# EAGLE design WarpDrive_201903 (EAGLE 6.1)

## Sheet 1 of 3
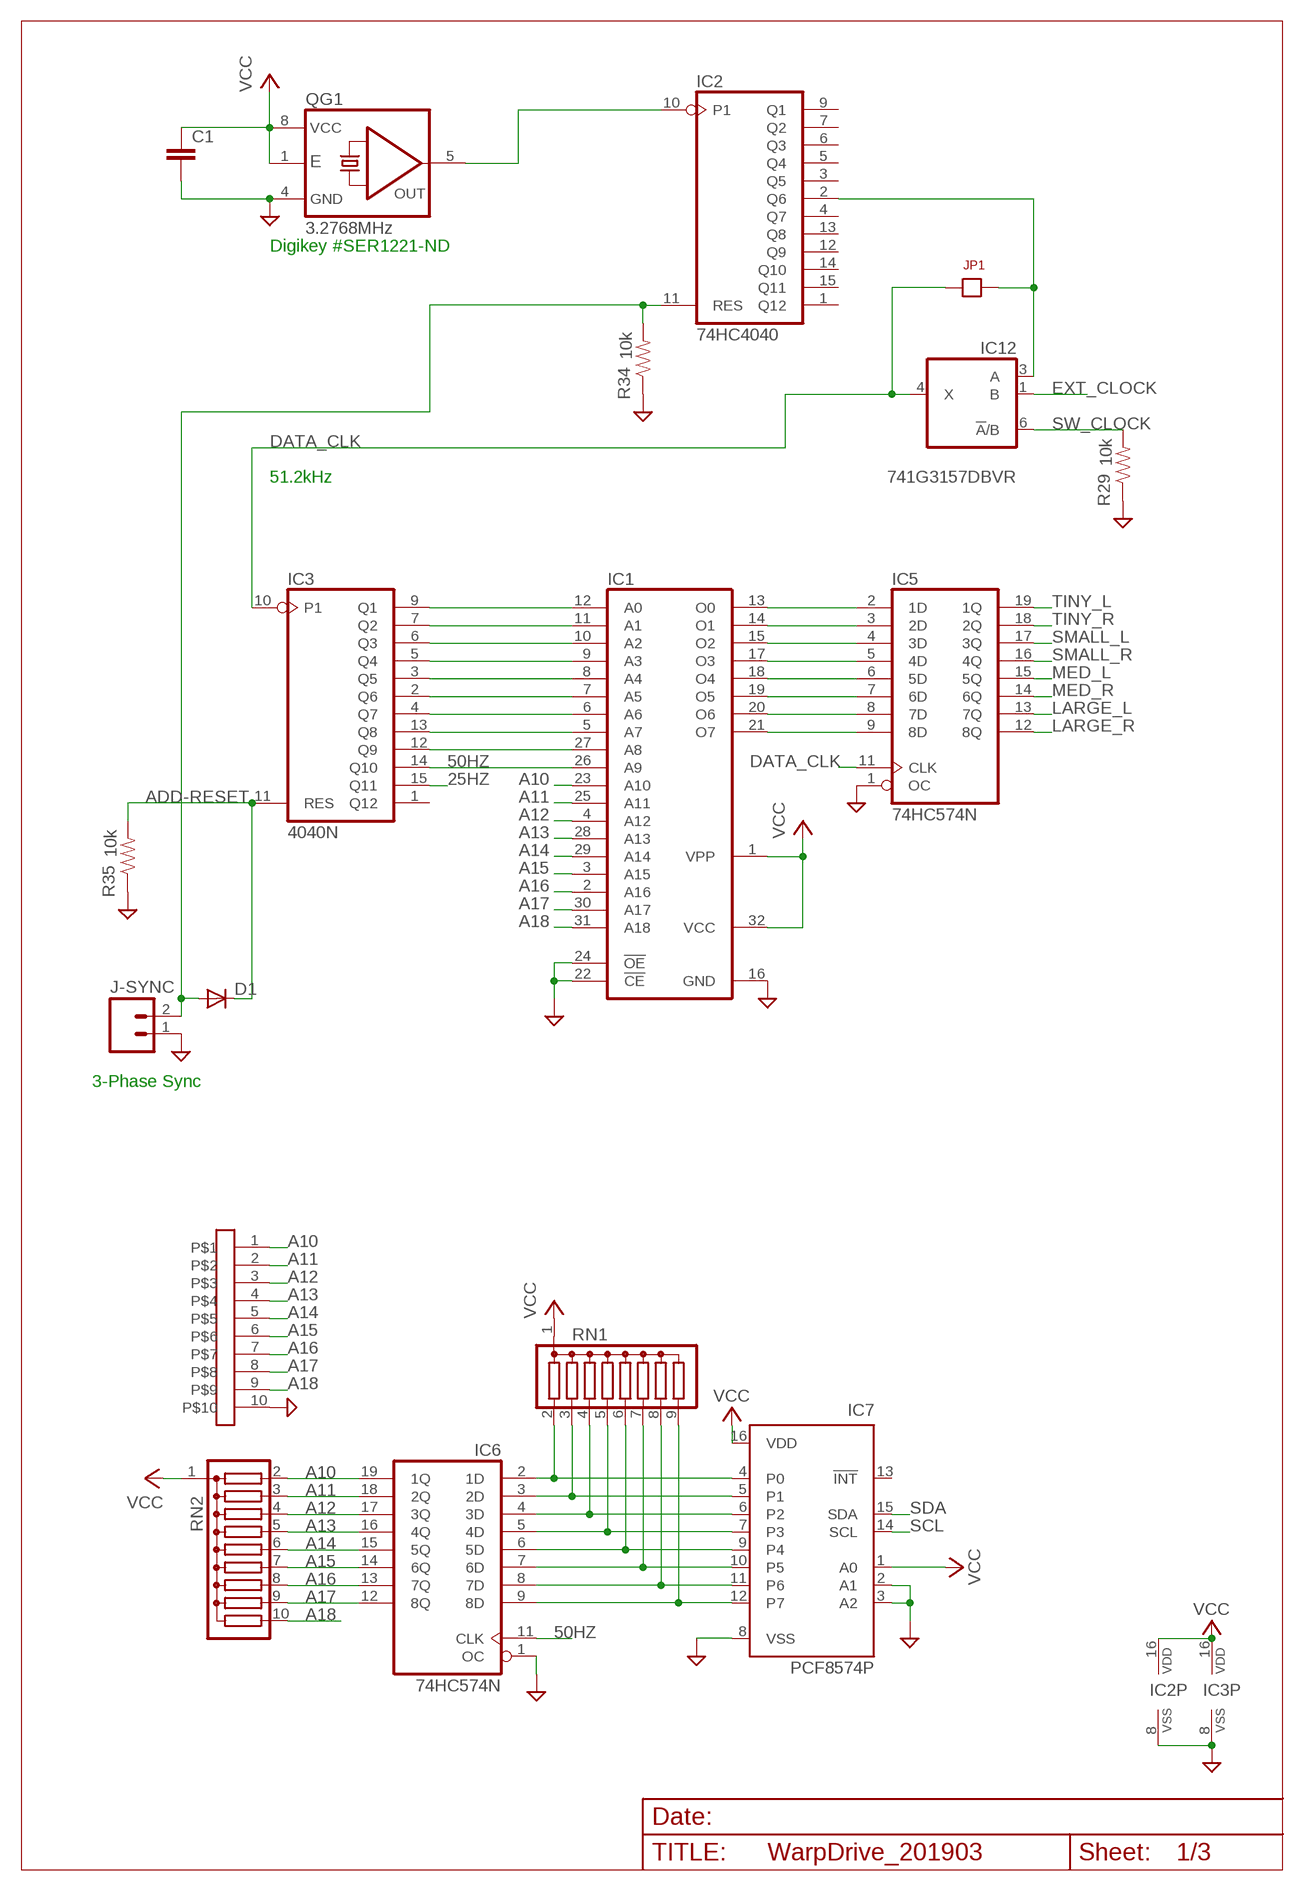
[diagram p0: schematic, sheet 1]

### Parts
C1  BCAP  [BCAP]
D1  1N4148DO35-7  [D3]
IC1  27C4001D  [DIL32]
IC2  74HC4040  4040N  [DIL16]
IC3  4040N  [DIL16]
IC5  74HC574N  [DIL20]
IC6  74HC574N  [DIL20]
IC7  PCF8574P  [DIL16]
IC12  741G3157DBVR  [DBV_R-PDSO-G6]
J1  SIL-STACK-10  [SIL-STACK-10]
J-SYNC  MO2POL  [MOLEX-1X2]
JP1  JP1  [JP1]
QG1  3.2768MHz  SG531  [DIL08-4]
R29  10k  R4  [AXIAL-0.4]
R34  10k  R4  [AXIAL-0.4]
R35  10k  R4  [AXIAL-0.4]
RN1  G08R  [SIL9]
RN2  G09R  [SIL10]

### Nets
25HZ: IC3.15(Q11)
50HZ: IC1.26(A9) IC3.14(Q10) IC6.11(CLK) ; also sheet 3
A10: IC1.23(A10) IC6.19(1Q) J1.1 RN2.2
A11: IC1.25(A11) IC6.18(2Q) J1.2 RN2.3
A12: IC1.4(A12) IC6.17(3Q) J1.3 RN2.4
A13: IC1.28(A13) IC6.16(4Q) J1.4 RN2.5
A14: IC1.29(A14) IC6.15(5Q) J1.5 RN2.6
A15: IC1.3(A15) IC6.14(6Q) J1.6 RN2.7
A16: IC1.2(A16) IC6.13(7Q) J1.7 RN2.8
A17: IC1.30(A17) IC6.12(8Q) J1.8 RN2.9
A18: IC1.31(A18) J1.9 RN2.10 ; also sheet 3
ADD-RESET: D1.C IC3.11(RES) R35.P$2 ; also sheet 3
DATA_CLK: IC3.10(P1) IC5.11(CLK) IC12.4(X) JP1.1 ; also sheet 3
EXT_CLOCK: IC12.1(B) ; also sheet 3
GND: C1.2 IC1.16(GND) IC1.22(!CE) IC1.24(!OE) IC2.8(VSS) IC3.8(VSS) IC5.1(OC) IC6.1(OC) IC7.2(A1) IC7.3(A2) IC7.8(VSS) J1.10 J-SYNC.1 QG1.4(GND) R29.P$1 R34.P$1 R35.P$1 ; also sheet 3
LARGE_L: IC5.13(7Q) ; also sheet 2
LARGE_R: IC5.12(8Q) ; also sheet 2
MED_L: IC5.15(5Q) ; also sheet 2
MED_R: IC5.14(6Q) ; also sheet 2
N$2: IC2.10(P1) QG1.5(OUT)
N$3: IC1.12(A0) IC3.9(Q1)
N$4: IC1.11(A1) IC3.7(Q2)
N$5: IC1.10(A2) IC3.6(Q3)
N$6: IC1.9(A3) IC3.5(Q4)
N$7: IC1.8(A4) IC3.3(Q5)
N$8: IC1.7(A5) IC3.2(Q6)
N$9: IC1.6(A6) IC3.4(Q7)
N$10: IC1.5(A7) IC3.13(Q8)
N$11: IC1.27(A8) IC3.12(Q9)
N$12: IC1.13(O0) IC5.2(1D)
N$13: IC2.2(Q6) IC12.3(A) JP1.2
N$14: IC1.14(O1) IC5.3(2D)
N$15: IC6.2(1D) IC7.4(P0) RN1.2
N$16: IC1.15(O2) IC5.4(3D)
N$17: IC1.17(O3) IC5.5(4D)
N$18: IC1.18(O4) IC5.6(5D)
N$19: IC1.19(O5) IC5.7(6D)
N$20: IC1.20(O6) IC5.8(7D)
N$21: IC1.21(O7) IC5.9(8D)
N$24: IC6.3(2D) IC7.5(P1) RN1.3
N$25: IC6.4(3D) IC7.6(P2) RN1.4
N$26: IC6.5(4D) IC7.7(P3) RN1.5
N$27: IC6.6(5D) IC7.9(P4) RN1.6
N$28: IC6.7(6D) IC7.10(P5) RN1.7
N$29: IC6.8(7D) IC7.11(P6) RN1.8
N$30: IC6.9(8D) IC7.12(P7) RN1.9
N$75: D1.A IC2.11(RES) J-SYNC.2 R34.P$2
SCL: IC7.14(SCL) ; also sheet 3
SDA: IC7.15(SDA) ; also sheet 3
SMALL_L: IC5.17(3Q) ; also sheet 2
SMALL_R: IC5.16(4Q) ; also sheet 2
SW_CLOCK: IC12.6(!A!/B) R29.P$2 ; also sheet 3
TINY_L: IC5.19(1Q) ; also sheet 2
TINY_R: IC5.18(2Q) ; also sheet 2
VCC: C1.1 IC1.1(VPP) IC1.32(VCC) IC2.16(VDD) IC3.16(VDD) IC7.1(A0) IC7.16(VDD) QG1.1(E) QG1.8(VCC) RN1.1 RN2.1 ; also sheet 3
Unconnected: IC2.1(Q12) IC2.3(Q5) IC2.4(Q7) IC2.5(Q4) IC2.6(Q3) IC2.7(Q2) IC2.9(Q1) IC2.12(Q9) IC2.13(Q8) IC2.14(Q10) IC2.15(Q11) IC3.1(Q12) IC7.13(!INT)

### Notes on the sheet
- Digikey #SER1221-ND
- 51.2kHz
- 3-Phase Sync

## Sheet 2 of 3
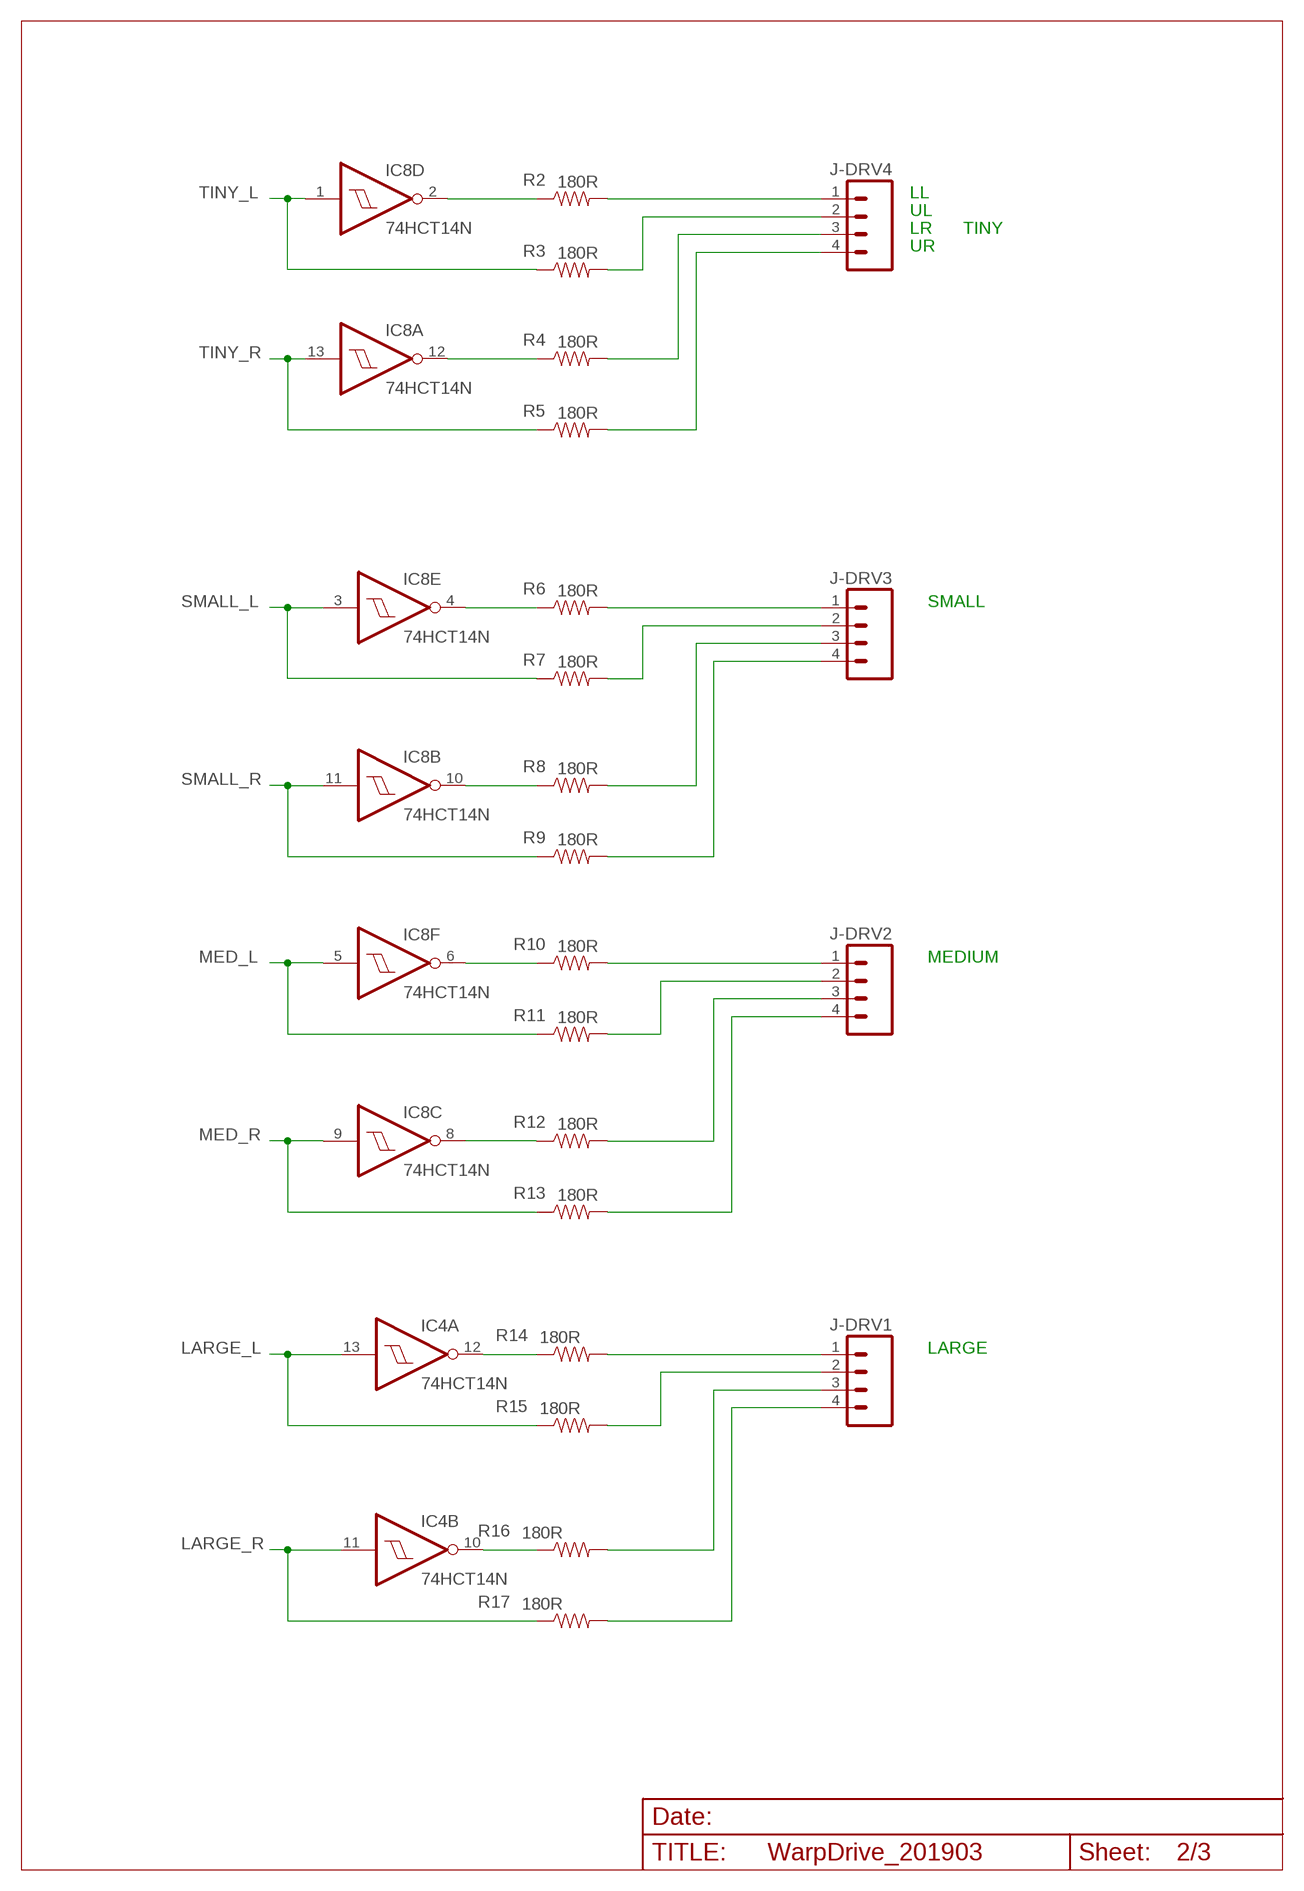
[diagram p1: schematic, sheet 2]

### Parts
IC4  74HCT14N  [DIL14]
IC8  74HCT14N  [DIL14]
J-DRV1  MO4POL  [MOLEX-4]
J-DRV2  MO4POL  [MOLEX-4]
J-DRV3  MO4POL  [MOLEX-4]
J-DRV4  MO4POL  [MOLEX-4]
R2  180R  R4  [AXIAL-0.4]
R3  180R  R4  [AXIAL-0.4]
R4  180R  R4  [AXIAL-0.4]
R5  180R  R4  [AXIAL-0.4]
R6  180R  R4  [AXIAL-0.4]
R7  180R  R4  [AXIAL-0.4]
R8  180R  R4  [AXIAL-0.4]
R9  180R  R4  [AXIAL-0.4]
R10  180R  R4  [AXIAL-0.4]
R11  180R  R4  [AXIAL-0.4]
R12  180R  R4  [AXIAL-0.4]
R13  180R  R4  [AXIAL-0.4]
R14  180R  R4  [AXIAL-0.4]
R15  180R  R4  [AXIAL-0.4]
R16  180R  R4  [AXIAL-0.4]
R17  180R  R4  [AXIAL-0.4]

### Nets
LARGE_L: IC4.13(A:I) R15.P$1 ; also sheet 1
LARGE_R: IC4.11(B:I) R17.P$1 ; also sheet 1
MED_L: IC8.5(F:I) R11.P$1 ; also sheet 1
MED_R: IC8.9(C:I) R13.P$1 ; also sheet 1
N$22: IC4.12(A:O) R14.P$1
N$23: IC4.10(B:O) R16.P$1
N$31: IC8.2(D:O) R2.P$1
N$32: J-DRV4.1 R2.P$2
N$33: J-DRV4.2 R3.P$2
N$34: IC8.12(A:O) R4.P$1
N$35: J-DRV4.3 R4.P$2
N$36: J-DRV4.4 R5.P$2
N$38: IC8.4(E:O) R6.P$1
N$39: J-DRV3.1 R6.P$2
N$41: J-DRV3.2 R7.P$2
N$44: IC8.10(B:O) R8.P$1
N$46: J-DRV3.3 R8.P$2
N$47: J-DRV3.4 R9.P$2
N$49: IC8.6(F:O) R10.P$1
N$50: J-DRV2.1 R10.P$2
N$52: J-DRV2.2 R11.P$2
N$55: IC8.8(C:O) R12.P$1
N$56: J-DRV2.3 R12.P$2
N$57: J-DRV2.4 R13.P$2
N$61: J-DRV1.1 R14.P$2
N$62: J-DRV1.2 R15.P$2
N$65: J-DRV1.3 R16.P$2
N$66: J-DRV1.4 R17.P$2
SMALL_L: IC8.3(E:I) R7.P$1 ; also sheet 1
SMALL_R: IC8.11(B:I) R9.P$1 ; also sheet 1
TINY_L: IC8.1(D:I) R3.P$1 ; also sheet 1
TINY_R: IC8.13(A:I) R5.P$1 ; also sheet 1
Unconnected: IC4.3(E:I) IC4.4(E:O) IC4.5(F:I) IC4.6(F:O) IC4.8(C:O) IC4.9(C:I)

### Notes on the sheet
- LL
- UL
- LR | TINY
- UR
- SMALL
- MEDIUM
- LARGE

## Sheet 3 of 3
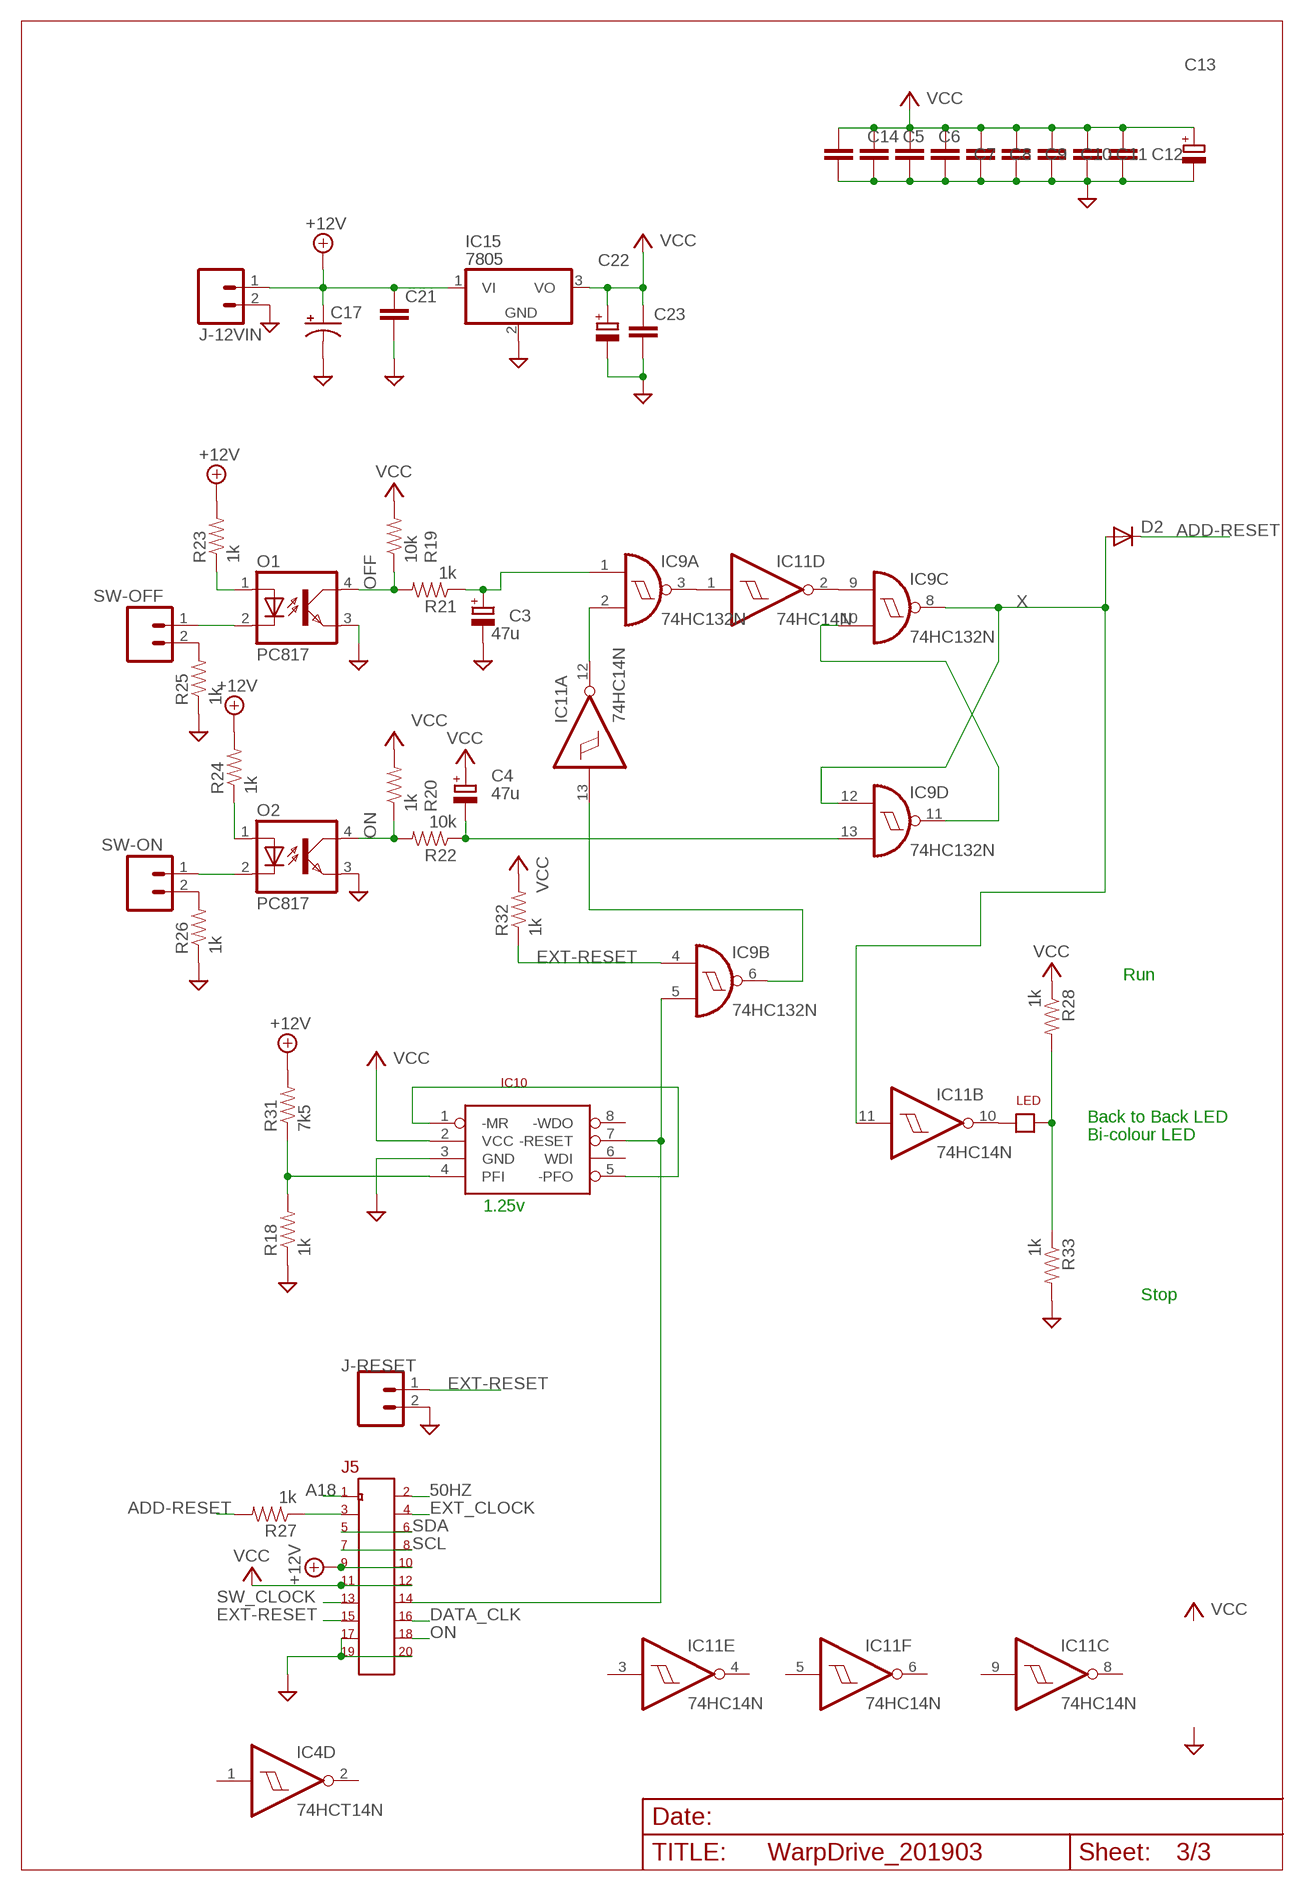
[diagram p2: schematic, sheet 3]

### Parts
C3  47u  C-RB200100  [CPOL-RADIAL-10UF-25V]
C4  47u  C-RB200100  [CPOL-RADIAL-10UF-25V]
C5  BCAP  [BCAP]
C6  BCAP  [BCAP]
C7  BCAP  [BCAP]
C8  BCAP  [BCAP]
C9  BCAP  [BCAP]
C10  BCAP  [BCAP]
C11  BCAP  [BCAP]
C12  BCAP  [BCAP]
C13  C-RB200100  [CPOL-RADIAL-10UF-25V]
C14  BCAP  [BCAP]
C17  CAP_POLPTH1  [CPOL-RADIAL-100UF-25V]
C21  BCAP  [BCAP]
C22  C-RB200100  [CPOL-RADIAL-10UF-25V]
C23  BCAP  [BCAP]
D2  1N4148DO35-7  [D3]
IC9  74HC132N  [DIL14]
IC10  ADM705  [DIL08]
IC11  74HC14N  [DIL14]
IC15  7805  7805TV  [TO220V]
J5  IDC20IDC20-SMALL  [IDC20-SMALL]
J-12VIN  MO2POL  [MOLEX-1X2]
J-RESET  MO2POL  [MOLEX-1X2]
LED  JP1  [JP1]
O1  PC817  [DIL04]
O2  PC817  [DIL04]
R18  1k  R4  [AXIAL-0.4]
R19  10k  R4  [AXIAL-0.4]
R20  1k  R4  [AXIAL-0.4]
R21  1k  R4  [AXIAL-0.4]
R22  10k  R4  [AXIAL-0.4]
R23  1k  R4  [AXIAL-0.4]
R24  1k  R4  [AXIAL-0.4]
R25  1k  R4  [AXIAL-0.4]
R26  1k  R4  [AXIAL-0.4]
R27  1k  R4  [AXIAL-0.4]
R28  1k  R4  [AXIAL-0.4]
R31  7k5  R4  [AXIAL-0.4]
R32  1k  R4  [AXIAL-0.4]
R33  1k  R4  [AXIAL-0.4]
SW-OFF  MO2POL  [MOLEX-1X2]
SW-ON  MO2POL  [MOLEX-1X2]

### Nets
50HZ: J5.2 ; also sheet 1
+12V: C17.1(+) C21.1 IC15.1(VI) J5.9 J5.10 J-12VIN.1 R23.P$2 R24.P$2 R31.P$2
A18: J5.1 ; also sheet 1
ADD-RESET: D2.C R27.P$2 ; also sheet 1
DATA_CLK: J5.16 ; also sheet 1
EXT-RESET: IC9.4(B:I0) J5.15 J-RESET.1 R32.P$1
EXT_CLOCK: J5.4 ; also sheet 1
GND: C3.2(-) C5.2 C6.2 C7.2 C8.2 C9.2 C10.2 C11.2 C12.2 C13.2(-) C14.2 C17.2(-) C21.2 C22.2(-) C23.2 IC10.3(GND) IC15.2(GND) J5.17 J5.19 J5.20 J-12VIN.2 J-RESET.2 O1.3(EMIT) O2.3(EMIT) R18.P$1 R25.P$1 R26.P$1 R33.P$2 ; also sheet 1
N$37: IC9.9(C:I0) IC11.2(D:O)
N$40: LED.2 R28.P$2 R33.P$1
N$42: R25.P$2 SW-OFF.2
N$43: J5.3 R27.P$1
N$45: R26.P$2 SW-ON.2
N$48: IC9.10(C:I1) IC9.11(D:O)
N$51: C3.1(+) IC9.1(A:I0) R21.P$1
N$53: IC9.3(A:O) IC11.1(D:I)
N$54: C4.2(-) IC9.13(D:I1) R22.P$1
N$58: O1.1(A) R23.P$1
N$60: O1.2(C) SW-OFF.1
N$63: O2.1(A) R24.P$1
N$67: O2.2(C) SW-ON.1
N$69: IC9.2(A:I1) IC11.12(A:O)
N$70: IC9.6(B:O) IC11.13(A:I)
N$71: IC9.5(B:I1) IC10.7(-RESET) J5.14
N$72: IC10.1(-MR) IC10.5(-PFO)
N$73: IC10.4(PFI) R18.P$2 R31.P$1
N$74: IC11.10(B:O) LED.1
OFF: O1.4(COL) R19.P$1 R21.P$2
ON: J5.18 O2.4(COL) R20.P$1 R22.P$2
SCL: J5.7 J5.8 ; also sheet 1
SDA: J5.5 J5.6 ; also sheet 1
SW_CLOCK: J5.13 ; also sheet 1
VCC: C4.1(+) C5.1 C6.1 C7.1 C8.1 C9.1 C10.1 C11.1 C12.1 C13.1(+) C14.1 C22.1(+) C23.1 IC10.2(VCC) IC15.3(VO) J5.11 J5.12 R19.P$2 R20.P$2 R28.P$1 R32.P$2 ; also sheet 1
X: D2.A IC9.8(C:O) IC9.12(D:I0) IC11.11(B:I)
Unconnected: IC4.1(D:I) IC4.2(D:O) IC10.6(WDI) IC10.8(-WDO) IC11.3(E:I) IC11.4(E:O) IC11.5(F:I) IC11.6(F:O) IC11.8(C:O) IC11.9(C:I)

### Notes on the sheet
- Run
- Back to Back LED
- Bi-colour LED
- 1.25v
- Stop

## Power pins joined to a net without a drawn wire
GND: IC4.7(P:GND) IC5.10(GND) IC6.10(GND) IC8.7(P:GND) IC9.7(P:GND) IC11.7(P:GND) IC12.2(GND)
VCC: IC4.14(P:VCC) IC5.20(VCC) IC6.20(VCC) IC8.14(P:VCC) IC9.14(P:VCC) IC11.14(P:VCC) IC12.5(VCC)

## Library data of the parts
C1 C5-C12 C14 C21 C23 = Andrew Misc:BCAP
C3 C4 C13 C22 = Andrew:C-RB200100
C17 = SparkFun-Passives:CAP_POL: Capacitor Polarized These are standard SMD and PTH capacitors. Normally 10uF, 47uF, and 100uF in electrolytic and tantalum varieties. Always verify the external diameter of the through hole cap, it varies with capacity, voltage, and manufacturer. The EIA devices should be standard.
D1 D2 = Andrew Misc:1N4148: DIODE high speed (Philips)
IC1 = memory-nec:27C4001D: MEMORY; MPN: M27C4001-12B1; OC_FARNELL: 3338137; OC_NEWARK: 37M4736
IC2 IC3 = 40xx:4040: 12-stage binary/ripple COUNTER
IC4 IC8 IC11 = 74xx-eu:74*14: Hex schmitt trigger INVERTER
IC5 IC6 = 74xx-eu:74*574: 8-bit D type FLIP FLOP bus driver
IC7 = micro-philips:PCF8574: I2C-Bus Remote 8-bit I/O expander http://www.semiconductors.philips.com/acrobat_download/datasheets/PCF8574_4.pdf; MPN: PCF8574PN; OC_FARNELL: 204020; OC_NEWARK: 11N8515
IC9 = 74xx-eu:74*132: Quad 2-input NAND schmitt trigger
IC10 = Andrew IC:ADM705
IC12 = 74xx-little-us:74*1G3157: Single-Pole, Double-Throw Analog Switch Source: http://focus.ti.com/lit/ds/symlink/sn74lvc1g3157.pdf
IC15 = Andrew Linear:78*: Positive VOLTAGE REGULATOR Source: http://cache.national.com/ds/LM/LM78L05.pdf http://www.fairchildsemi.com/ds/LM/LM7805.pdf
J1 = Andrew_Connectors:SIL-STACK-10
J5 = Andrew Connectors:IDC20
J-12VIN J-RESET SW-OFF SW-ON = Andrew Connectors:MO2POL
J-DRV1-J-DRV4 = Andrew_Connectors:MO4POL
J-SYNC = Andrew_Connectors:MO2POL
JP1 LED = Andrew_Connectors:JP1
O1 O2 = Andrew:PC817: SHARP OPTO COUPLER; MPN: PC817X4J000F; OC_FARNELL: 9707727; OC_NEWARK: 97K7059
QG1 = Andrew IC:SG531: CRYSTAL RESONATOR; MPN: SG531P16MHZ; OC_FARNELL: unknown; OC_NEWARK: 01M8837
R2-R29 R31-R35 = Andrew Misc:R4
RN1 = Andrew Misc:G08R: SIL RESISTOR; OC_FARNELL: unknown; OC_NEWARK: unknown
RN2 = Andrew Misc:G09R: SIL RESISTOR; OC_FARNELL: unknown; OC_NEWARK: unknown

## Board
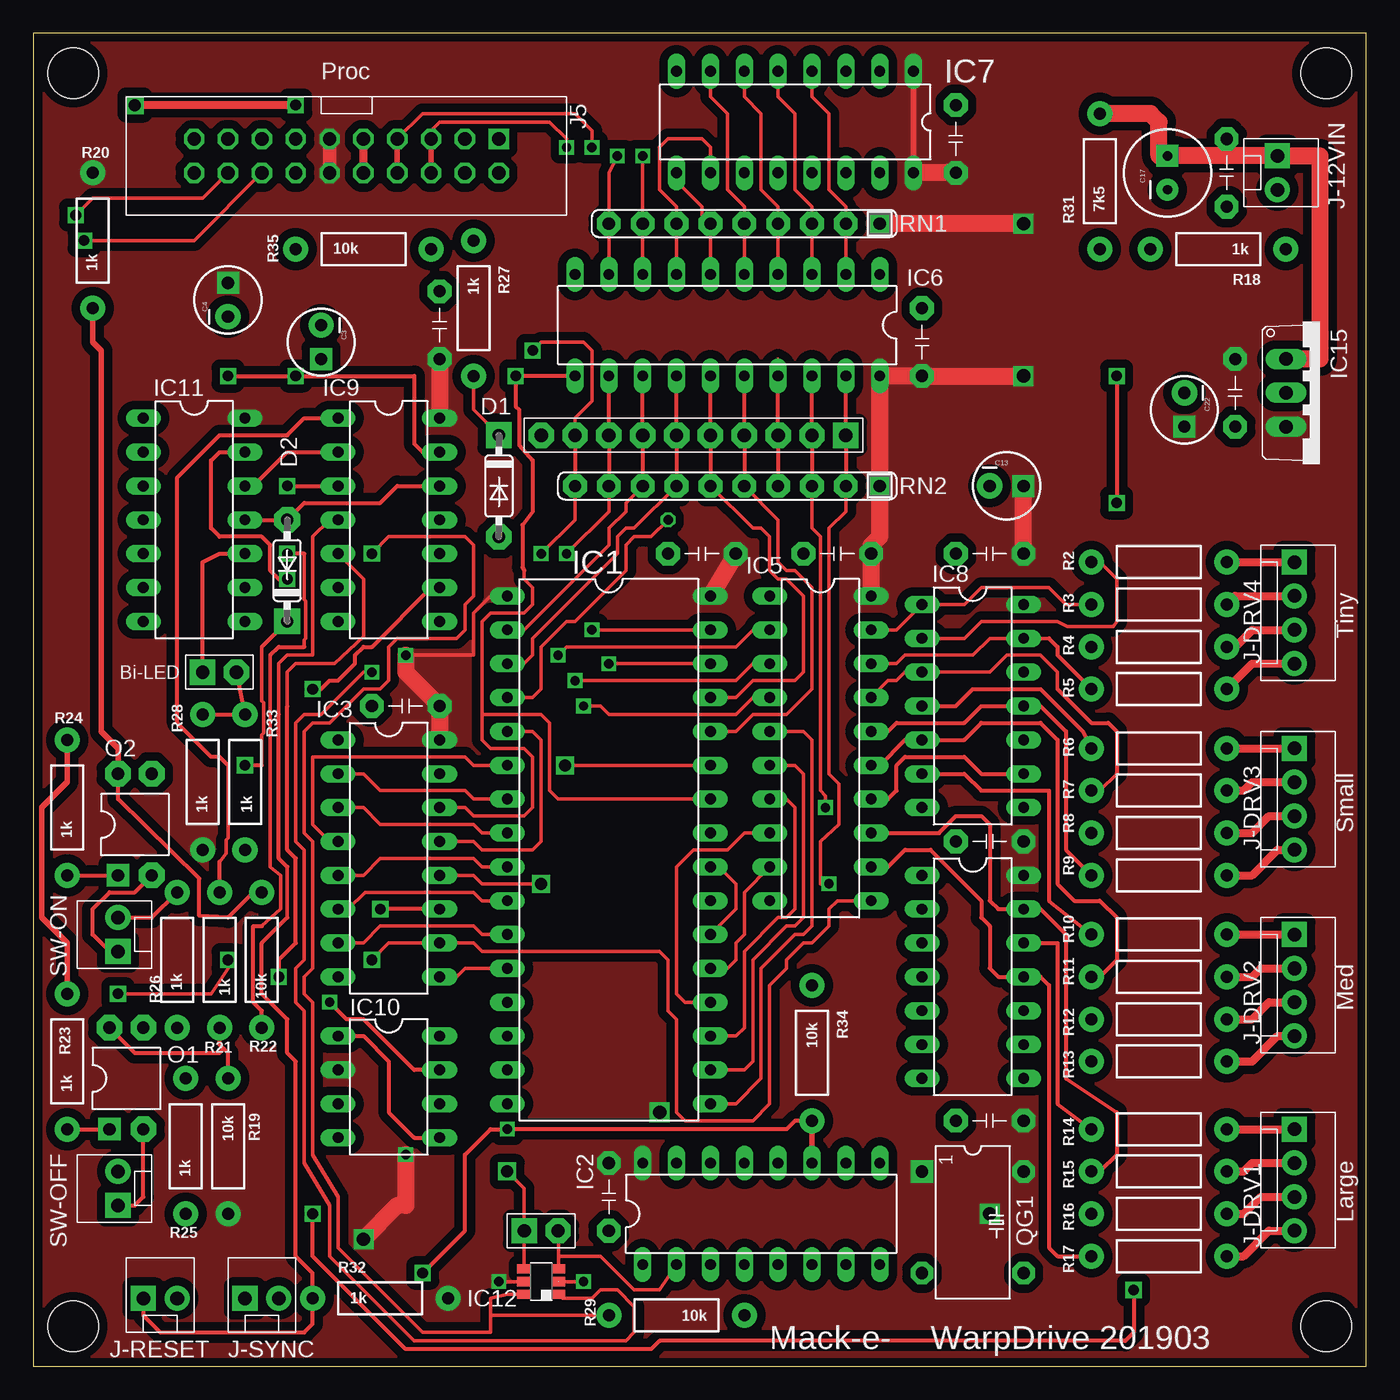
[diagram p3: board, top side]
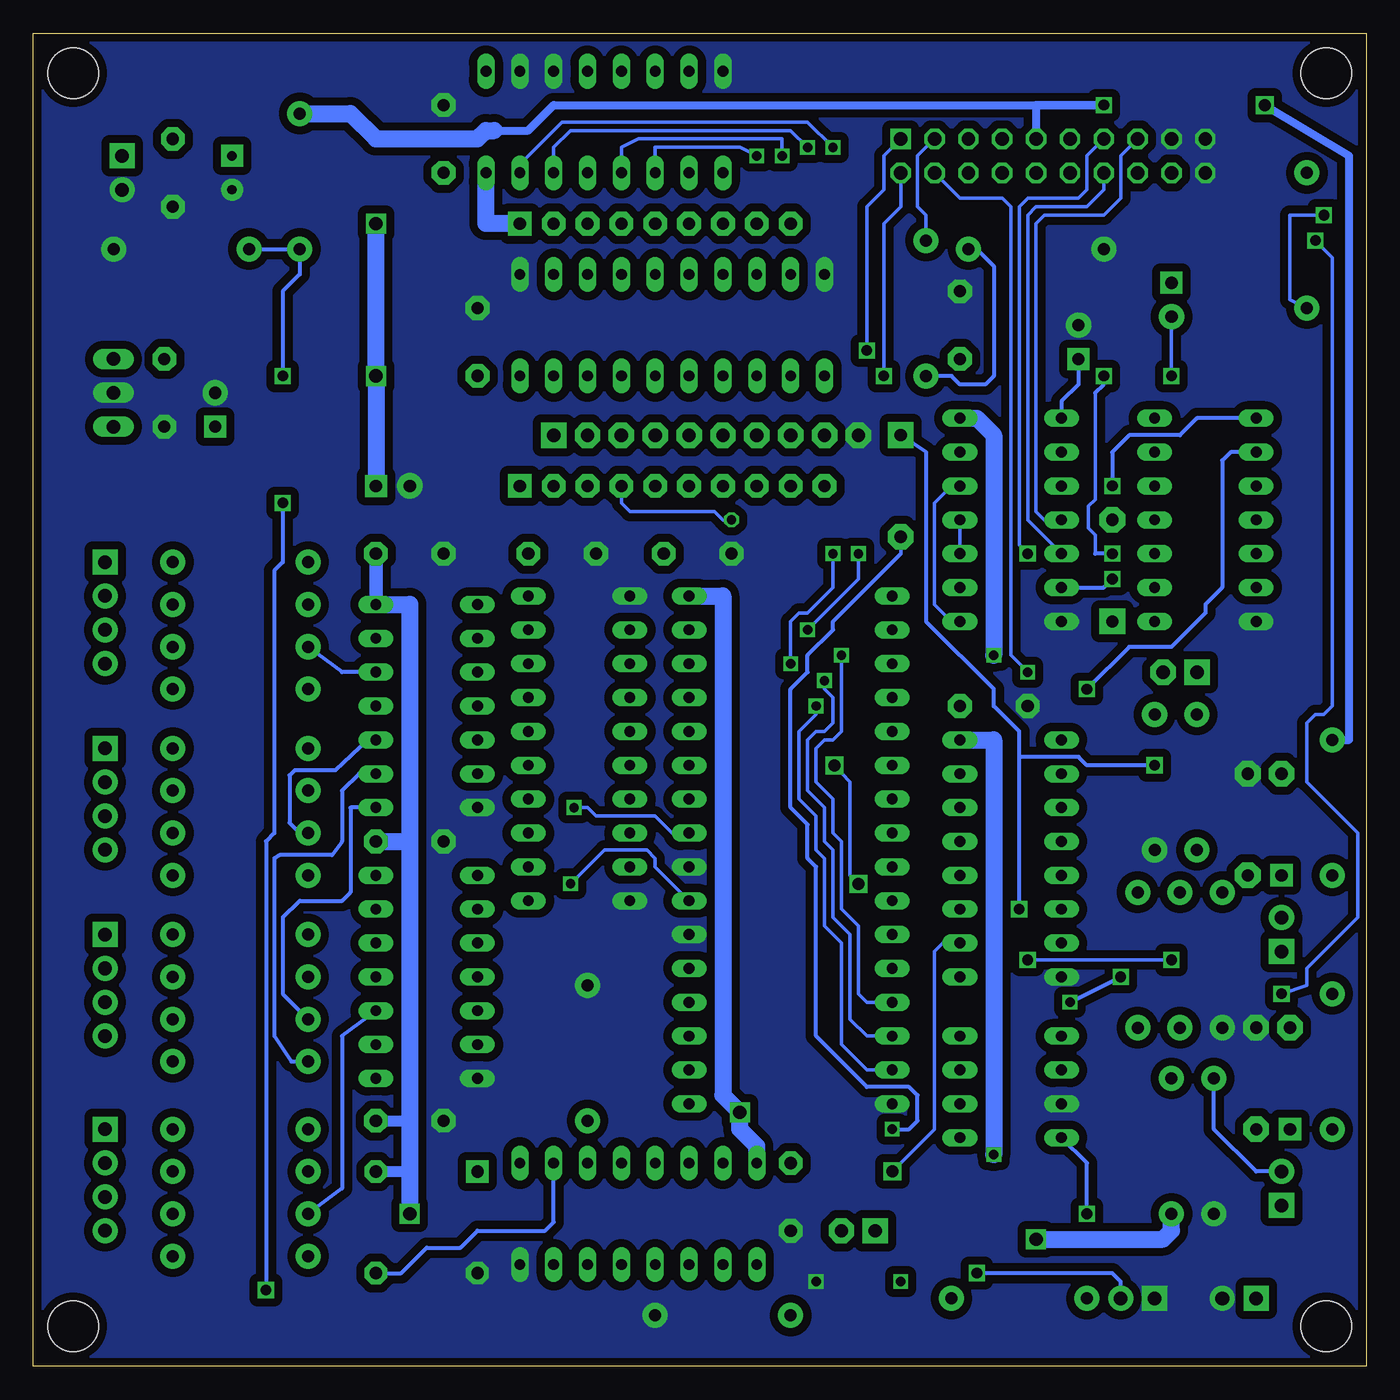
[diagram p4: board, bottom side, seen from below]

Size 100 x 100 mm. Coordinates in mm from the lower left corner, seen from the top.
Outline: 0,0 100,0 100,100 0,100 0,0
Copper layers (1*16): Top 0.035mm / dielectric 1.5mm / Bottom 0.035mm
Design rules: minimum track width 10mil, minimum drill 27mil, track to track 10mil, track to pad 10mil, pad to pad 10mil, via to via 10mil, smd to smd 10mil, copper to edge 15mil, drill to drill 8mil, minimum pad ring 10mil, minimum via ring 8mil, stop-mask expansion 4mil, vias tented up to drill 0mil, thermal gap 10mil
Holes 3.81 mm at 3,3 3,97 97,97 97,3

### Footprints (pad centres in the part's own frame; a part is rotated, then mirrored left to right if it is on the bottom)
BCAP = drill 0.914 pad 1.778 octagon: 1 -2.54,0; 2 2.54,0
CPOL-RADIAL-10UF-25V = drill 0.914 pad 1.651 square: 1 1.27,0 | drill 0.914 pad 1.905: 2 -1.27,0
CPOL-RADIAL-100UF-25V = drill 0.7 pad 1.651 square: 1 1.27,0 | drill 0.7 pad 1.651: 2 -1.27,0
D3 = drill 0.914 pad 1.93 octagon: A 3.81,0 | drill 0.914 pad 1.93 square: C -3.81,0
DIL32 = drill 0.813 long: 1 -19.05,-7.62; 2 -16.51,-7.62; 3 -13.97,-7.62; 4 -11.43,-7.62; 5 -8.89,-7.62; 6 -6.35,-7.62; 7 -3.81,-7.62; 8 -1.27,-7.62; 9 1.27,-7.62; 10 3.81,-7.62; 11 6.35,-7.62; 12 8.89,-7.62; 13 11.43,-7.62; 14 13.97,-7.62; 15 16.51,-7.62; 16 19.05,-7.62; 17 19.05,7.62; 18 16.51,7.62; 19 13.97,7.62; 20 11.43,7.62; 21 8.89,7.62; 22 6.35,7.62; 23 3.81,7.62; 24 1.27,7.62; 25 -1.27,7.62; 26 -3.81,7.62; 27 -6.35,7.62; 28 -8.89,7.62; 29 -11.43,7.62; 30 -13.97,7.62; 31 -16.51,7.62; 32 -19.05,7.62
DIL16 = drill 0.813 long: 1 -8.89,-3.81; 2 -6.35,-3.81; 3 -3.81,-3.81; 4 -1.27,-3.81; 5 1.27,-3.81; 6 3.81,-3.81; 7 6.35,-3.81; 8 8.89,-3.81; 9 8.89,3.81; 10 6.35,3.81; 11 3.81,3.81; 12 1.27,3.81; 13 -1.27,3.81; 14 -3.81,3.81; 15 -6.35,3.81; 16 -8.89,3.81
DIL14 = drill 0.813 long: 1 -7.62,-3.81; 2 -5.08,-3.81; 3 -2.54,-3.81; 4 0,-3.81; 5 2.54,-3.81; 6 5.08,-3.81; 7 7.62,-3.81; 8 7.62,3.81; 9 5.08,3.81; 10 2.54,3.81; 11 0,3.81; 12 -2.54,3.81; 13 -5.08,3.81; 14 -7.62,3.81
DIL20 = drill 0.813 long: 1 -11.43,-3.81; 2 -8.89,-3.81; 3 -6.35,-3.81; 4 -3.81,-3.81; 5 -1.27,-3.81; 6 1.27,-3.81; 7 3.81,-3.81; 8 6.35,-3.81; 9 8.89,-3.81; 10 11.43,-3.81; 11 11.43,3.81; 12 8.89,3.81; 13 6.35,3.81; 14 3.81,3.81; 15 1.27,3.81; 16 -1.27,3.81; 17 -3.81,3.81; 18 -6.35,3.81; 19 -8.89,3.81; 20 -11.43,3.81
DIL08 = drill 0.813 long: 1 -3.81,-3.81; 2 -1.27,-3.81; 3 1.27,-3.81; 4 3.81,-3.81; 5 3.81,3.81; 6 1.27,3.81; 7 -1.27,3.81; 8 -3.81,3.81
DBV_R-PDSO-G6 = smd 0.69 x 0.99: 1 -0.95,-1.29; 2 0,-1.29; 3 0.95,-1.29; 4 0.95,1.3; 5 0,1.3; 6 -0.95,1.3
TO220V = drill 1.016 long: 1 -2.54,-2.54; 2 0,-2.54; 3 2.54,-2.54
SIL-STACK-10 = drill 1 pad 1.905 square: 1 -11.43,0 | drill 1 pad 1.905 octagon: 2 -8.89,0; 3 -6.35,0; 4 -3.81,0; 5 -1.27,0; 6 1.27,0; 7 3.81,0; 8 6.35,0; 9 8.89,0; 10 11.43,0
IDC20-SMALL = drill 1 pad 1.524 square: 1 -11.43,-1.27 | drill 1 pad 1.524 octagon: 2 -11.43,1.27; 3 -8.89,-1.27; 4 -8.89,1.27; 5 -6.35,-1.27; 6 -6.35,1.27; 7 -3.81,-1.27; 8 -3.81,1.27; 9 -1.27,-1.27; 10 -1.27,1.27; 11 1.27,-1.27; 12 1.27,1.27; 13 3.81,-1.27; 14 3.81,1.27; 15 6.35,-1.27; 16 6.35,1.27; 17 8.89,-1.27; 18 8.89,1.27; 19 11.43,-1.27; 20 11.43,1.27
MOLEX-1X2 = drill 1.016 pad 1.88 square: 1 0,0 | drill 1.016 pad 1.88: 2 2.54,0
MOLEX-4 = drill 1.016 pad 1.88 square: 1 -3.81,0 | drill 1.016 pad 1.88: 2 -1.27,0; 3 1.27,0; 4 3.81,0
JP1 = drill 1 pad 1.905 square: 1 -1.27,0 | drill 1 pad 1.905 octagon: 2 1.27,0
DIL04 = drill 0.914 pad 1.676 square: 1 -1.27,-3.81 | drill 0.914 pad 1.93 octagon: 2 1.27,-3.81; 3 1.27,3.81; 4 -1.27,3.81
DIL08-4 = drill 0.914 pad 1.676 square: 1 -3.81,-3.81 | drill 0.914 pad 1.676 octagon: 4 3.81,-3.81; 5 3.81,3.81; 8 -3.81,3.81
AXIAL-0.4 = drill 0.9 pad 1.88: P$1 -5.08,0; P$2 5.08,0
SIL9 = drill 0.914 pad 1.778 square: 1 -10.16,0 | drill 0.914 pad 1.778 octagon: 2 -7.62,0; 3 -5.08,0; 4 -2.54,0; 5 0,0; 6 2.54,0; 7 5.08,0; 8 7.62,0; 9 10.16,0
SIL10 = drill 0.914 pad 1.778 square: 1 -11.43,0 | drill 0.914 pad 1.778 octagon: 2 -8.89,0; 3 -6.35,0; 4 -3.81,0; 5 -1.27,0; 6 1.27,0; 7 3.81,0; 8 6.35,0; 9 8.89,0; 10 11.43,0

### Placement (x,y rotation side)
C1  71.75,18.41 180 top
C3  21.59,76.83 270 top
C4  14.61,80.01 90 top
C5  90.17,73.03 270 top
C6  69.22,92.08 90 top
C7  66.67,76.83 90 top
C8  27.94,49.53 180 top
C9  43.18,12.7 270 top
C10  50.16,60.96 180 top
C11  60.33,60.96 180 top
C12  30.48,78.11 90 top
C13  73.03,66.04 0 top
C14  71.75,39.37 180 top
C17  85.09,89.53 90 top
C21  89.53,89.53 270 top
C22  86.36,71.75 270 top
C23  71.75,60.96 180 top
D1  34.92,66.04 270 top
D2  19.05,59.69 90 top
IC1  43.18,38.73 270 top
IC2  54.61,11.43 0 top
IC3  26.67,38.1 270 top
IC4  70.48,29.21 270 top
IC5  59.05,46.35 270 top
IC6  52.07,78.11 180 top
IC7  57.15,93.34 180 top
IC8  70.48,49.53 270 top
IC9  26.67,63.5 270 top
IC10  26.67,20.95 270 top
IC11  12.06,63.5 270 top
IC12  38.1,6.35 90 top
IC15  96.52,73.03 270 top
J1  49.53,69.85 180 top
J5  23.5,90.81 180 top
J-12VIN  93.34,90.81 270 top
J-DRV1  94.61,13.97 270 top
J-DRV2  94.61,28.57 270 top
J-DRV3  94.61,42.55 270 top
J-DRV4  94.61,56.52 270 top
J-RESET  8.26,5.08 0 top
J-SYNC  15.88,5.08 0 top
JP1  38.1,10.16 0 top
LED  13.97,52.07 0 top
O1  6.99,21.59 0 top
O2  7.62,40.64 0 top
QG1  70.48,10.79 270 top
R2  84.45,60.33 0 top
R3  84.45,57.15 0 top
R4  84.45,53.98 0 top
R5  84.45,50.8 0 top
R6  84.45,46.35 0 top
R7  84.45,43.18 0 top
R8  84.45,40.01 0 top
R9  84.45,36.83 0 top
R10  84.45,32.38 0 top
R11  84.45,29.21 0 top
R12  84.45,26.04 0 top
R13  84.45,22.86 0 top
R14  84.45,17.78 0 top
R15  84.45,14.61 0 top
R16  84.45,11.43 0 top
R17  84.45,8.26 0 top
R18  88.9,83.82 180 top
R19  14.61,16.51 270 top
R20  4.45,84.45 90 top
R21  13.97,30.48 270 top
R22  17.14,30.48 90 top
R23  2.54,22.86 90 top
R24  2.54,41.91 90 top
R25  11.43,16.51 90 top
R26  10.79,30.48 90 top
R27  33.02,79.38 270 top
R28  12.7,43.81 90 top
R29  48.26,3.81 180 top
R31  80.01,88.9 90 top
R32  26.04,5.08 0 top
R33  15.88,43.81 270 top
R34  58.42,23.5 270 top
R35  24.77,83.82 0 top
RN1  53.34,85.72 180 top
RN2  52.07,66.04 180 top
SW-OFF  6.35,12.06 90 top
SW-ON  6.35,31.11 90 top

### Tracks (layer width: path | path; a pad name or v marks a point on that pad's centre or on a via)
50HZ  (via drill 0.8)
  Top 0.254: IC1.26 39.37,42.55 38.73,43.18 38.73,48.26 38.1,48.9 33.66,48.9 | 33.66,48.9 33.66,46.99 34.29,46.35 36.83,46.35 37.47,45.72 37.47,41.91 36.83,41.27 33.02,41.27 32.38,41.91 IC3.14 | 36.83,59.69 36.83,59.05 37.47,58.42 37.47,57.15 36.83,56.52 34.29,56.52 33.66,55.88 33.66,48.9
  Top 0.305: IC6.11 v36.2,74.3 36.2,72.01 36.45,71.75 36.45,69.09 37.47,67.94 37.47,64.14 36.7,63.12 36.7,59.94 36.83,59.69
  Bottom 0.254: v36.2,74.3 36.2,85.72 34.92,87 J5.2
+12V  (via drill 0.8, 0.9)
  Top 0.254: C21.1 89.53,90.81
  Top 0.406: R23.P$2 2.54,31.75 0.64,33.66 0.64,41.91 2.54,43.81 R24.P$2
  Top 0.61: J5.10 J5.9 | v19.68,94.61 v7.62,94.61
  Top 1.27: R31.P$2 83.82,93.98 84.45,93.34 84.45,90.81 C17.1 89.53,90.81 J-12VIN.1 96.52,90.81 96.52,75.56 IC15.1
  Bottom 0.61: 65.41,92.71 62.87,92.71 60.96,94.61 v19.68,94.61 24.77,94.61 J5.9 | v7.62,94.61 1.27,90.81 1.27,46.99 R24.P$2
  Bottom 1.27: R31.P$2 76.2,93.98 74.3,92.08 66.67,92.08 66.04,92.71 65.41,92.71
A10  (via drill 0.7)
  Top 0.254: RN2.2 60.96,64.14 59.69,62.87 59.69,44.45 60.45,43.69 60.45,40.64 59.05,39.37 59.05,36.2 v59.69,36.2
  Top 0.305: IC6.19 J1.1 RN2.2
  Bottom 0.254: v59.69,36.2 57.15,38.73 53.98,38.73 53.34,38.1 53.34,37.47 IC1.23
A11  (via drill 0.7)
  Top 0.254: RN2.3 58.42,62.87 59.05,62.23 59.05,43.18 59.44,42.8 v59.44,41.91
  Top 0.305: IC6.18 J1.2 RN2.3
  Bottom 0.254: v59.44,41.91 58.42,41.91 57.78,41.27 53.34,41.27 52.07,40.01 IC1.25
A12  (via drill 0.7)
  Top 0.254: IC1.4 37.47,50.16 38.1,50.8 38.1,53.98 40.01,55.88 40.64,55.88 44.45,59.69 44.45,61.59 45.09,62.23 46.35,62.23 v47.62,63.5 | 55.88,75.56 55.88,73.66
  Top 0.305: IC6.17 55.88,73.66 J1.3 RN2.4
  Bottom 0.254: v47.62,63.5 48.26,63.5 48.9,64.14 55.24,64.14 55.88,64.77 RN2.4
A13
  Top 0.254: IC1.28 52.7,47.62 53.98,48.9 56.52,48.9 58.42,50.8 58.42,58.42 57.15,59.69 56.52,59.69 55.88,60.33 55.88,63.5 RN2.5
  Top 0.305: IC6.16 J1.4 RN2.5
A14
  Top 0.254: IC1.29 52.7,50.16 53.98,51.44 57.15,51.44 57.78,52.07 57.78,57.78 56.52,59.05 55.88,59.05 55.24,59.69 55.24,62.23 54.61,62.87 53.98,62.87 RN2.6
  Top 0.305: IC6.15 J1.5 RN2.6
A15
  Top 0.254: IC1.3 36.83,52.7 37.47,53.34 37.47,54.61 43.81,60.96 43.81,62.23 44.45,62.87 45.09,62.87 RN2.7
  Top 0.305: IC6.14 J1.6 RN2.7
A16
  Top 0.254: IC1.2 36.83,55.24 43.18,61.59 43.18,62.87 44.45,64.14 44.45,64.77 RN2.8
  Top 0.305: IC6.13 J1.7 RN2.8
A17  (via drill 0.7)
  Top 0.254: RN2.9 43.18,64.14 v40.01,60.96 | v43.18,52.7 IC1.30
  Top 0.305: IC6.12 J1.8 RN2.9
  Bottom 0.254: v40.01,60.96 40.01,58.42 41.91,56.52 42.55,56.52 43.18,55.88 v43.18,52.7
A18  (via drill 0.7, 0.8)
  Top 0.254: RN2.10 40.64,63.5 v38.1,60.96 | v41.91,55.24 IC1.31 | J1.9 40.64,71.12 41.91,72.39 41.91,76.2 41.27,76.83 38.1,76.83 v37.47,76.2
  Top 0.305: J1.9 RN2.10
  Bottom 0.254: v38.1,60.96 38.1,59.05 v41.91,55.24 | v37.47,76.2 37.47,87 36.2,88.27 36.2,90.81 J5.1
ADD-RESET  (via drill 0.8)
  Top 0.254: R27.P$2 33.02,71.75 D1.C | 17.14,53.98 17.14,49.91 17.27,49.78 17.27,47.5 17.14,47.37 17.14,45.09
  Top 0.305: IC3.11 v26.04,34.29 | D2.C 17.14,53.98 | 17.14,45.09 v15.88,45.09
  Bottom 0.305: v26.04,34.29 26.04,45.72 | 26.04,45.72 26.04,47.62 27.94,49.53 27.94,50.8 33.02,55.88 33.02,68.58 D1.C | R35.P$2 29.21,83.82 27.94,82.55 27.94,74.3 28.57,73.66 30.48,73.66 31.11,74.3 R27.P$2 | v15.88,45.09 20.95,45.09 21.59,45.72 26.04,45.72
DATA_CLK  (via drill 0.8, 0.9)
  Top 0.254: IC5.11 60.33,34.92 59.69,34.29 59.69,33.02 58.42,31.75 57.78,31.75 56.52,30.48 56.52,29.84 55.24,28.57 55.24,19.68 53.98,18.41 48.9,18.41 48.26,19.05 48.26,26.04 47.62,26.67 47.62,30.48 46.99,31.11 33.66,31.11 33.02,31.75 IC3.10 26.67,31.75 v25.4,30.48 | IC12.4 36.8,10.13 JP1.1 36.83,13.34 v35.56,14.61 | v3.81,84.45 12.06,84.45 J5.16 | v6.35,27.94 13.34,27.94 14.61,29.84 v14.61,30.48
  Bottom 0.254: IC3.10 31.75,31.75 32.38,31.11 32.38,17.78 v35.56,14.61 | v6.35,27.94 4.45,28.57 4.45,29.84 0.64,33.66 0.64,40.01 4.45,43.81 4.45,48.26 3.81,48.9 3.17,48.9 2.54,49.53 2.54,83.19 v3.81,84.45 | v14.61,30.48 v25.4,30.48
EXT-RESET
  Top 0.254: 19.05,33.66 19.05,37.47 | 18.41,48.9 18.41,52.7 19.05,53.34 20.95,53.34 20.95,62.23 22.23,63.5 IC9.4
  Top 0.305: J-RESET.1 8.26,3.81 9.53,2.54 20.32,2.54 20.95,3.17 R32.P$1 20.95,6.99 19.68,8.26 19.68,22.86 19.05,23.5 19.05,26.04 17.14,27.94 17.14,31.75 19.05,33.66 | 19.05,37.47 18.41,38.1 18.41,48.9
  Bottom 0.254: IC9.4 24.13,63.5 24.77,64.14 24.77,85.72 24.13,86.36 19.68,86.36 18.41,87.63 18.41,90.81 J5.15
EXT_CLOCK  (via drill 0.7)
  Top 0.254: v25.4,52.07 24.77,52.07 21.59,48.9 20.32,48.9 19.68,48.26 19.68,39.37 20.32,38.73 20.32,38.1 20.32,30.48 19.68,29.84 19.68,27.3 20.32,26.67 20.32,15.24 22.23,12.06 22.23,8.26 28.57,1.91 44.45,1.91 45.09,2.54 45.09,4.45 43.81,5.71 42.55,5.71 41.91,5.08 39.71,5.08 IC12.1
  Bottom 0.254: v25.4,52.07 26.67,53.34 26.67,87 27.3,87.63 30.48,87.63 J5.4
GND  (via drill 0.7)
  Top 0.254: IC1.24 51.44,37.47 52.7,36.2 52.7,34.29 IC1.22 | IC12.2 v41.27,6.35
  pour Bottom (isolate 0.61, no thermals): 0.64,0.64 0.64,99.06 0.64,99.69 99.69,99.69 99.69,0.64
LARGE_L
  Top 0.305: R15.P$1 80.01,14.61 81.28,15.88 81.28,19.05 77.47,21.59 77.47,32.38 75.56,34.29 IC4.13 72.39,34.29 71.75,34.92 71.75,40.64 71.12,41.27 69.22,41.27 67.94,40.01 IC5.13
LARGE_R
  Top 0.305: IC5.12 64.14,37.47 65.41,38.73 67.31,38.73 71.12,34.92 71.12,33.66 71.75,33.02 71.75,29.84 72.39,29.21 IC4.11 75.56,29.21 76.2,28.57 76.2,8.89 76.83,8.26 R17.P$1
MED_L
  Top 0.305: IC5.15 63.5,45.09 65.41,46.99 IC8.5 69.85,46.99 71.12,48.26 75.56,48.26 76.83,46.99 76.83,36.2 78.11,34.92 80.01,34.92 81.28,33.66 81.28,30.48 80.01,29.21 R11.P$1
MED_R
  Top 0.305: IC5.14 64.14,42.55 64.77,43.18 64.77,45.09 65.41,45.72 69.85,45.72 71.12,44.45 IC8.9
  Bottom 0.305: IC8.9 75.56,44.45 76.83,43.18 76.83,39.37 77.6,38.35 81.53,38.35 81.92,38.1 81.92,37.97 81.92,24.77 80.64,22.86 R13.P$1
N$2
  Bottom 0.305: QG1.5 72.39,6.99 70.48,8.89 67.94,8.89 66.67,10.16 61.59,10.16 60.96,10.79 IC2.10
N$3
  Top 0.254: IC3.9 31.75,29.21 32.38,29.84 IC1.12
N$4
  Top 0.254: IC3.7 24.77,31.75 26.04,33.02 33.02,33.02 33.66,32.38 IC1.11
N$5
  Top 0.254: IC3.6 23.62,34.29 24.89,35.56 33.02,35.56 33.66,34.92 IC1.10
N$6
  Top 0.254: IC1.9 33.66,37.47 33.02,38.1 26.04,38.1 24.77,36.83 IC3.5
N$7
  Top 0.254: IC3.3 24.77,41.91 26.04,40.64 33.02,40.64 33.66,40.01 IC1.8
N$8
  Top 0.254: IC3.2 24.77,44.45 26.04,43.18 32.38,43.18 33.02,42.55 IC1.7
N$9
  Top 0.254: IC3.4 22.23,39.37 20.95,40.64 20.95,45.72 32.38,45.72 33.02,45.09 IC1.6
N$10
  Top 0.254: IC3.13 33.02,39.37 33.66,38.73 37.47,38.73 38.1,39.37 38.1,46.99 37.47,47.62 IC1.5
N$11  (via drill 0.9)
  Top 0.254: IC3.12 33.02,36.83 33.66,36.2 v38.1,36.2 | v39.88,45.09 40.01,45.09 IC1.27
  Bottom 0.254: v38.1,36.2 38.73,36.83 38.73,43.81 v39.88,45.09
N$12  (via drill 0.7)
  Top 0.254: IC5.2 53.98,55.24 52.7,53.98 40.01,53.98 v39.37,53.34
  Bottom 0.254: v39.37,53.34 39.37,47.62 40.01,46.99 40.64,46.99 41.27,46.35 41.27,43.81 40.01,42.55 40.01,40.01 39.37,39.37 39.37,34.29 38.1,33.02 38.1,27.94 37.47,27.3 IC1.13
N$13
  Top 0.254: IC12.3 39.39,8.26 | 39.39,8.26 39.39,10.14 JP1.2 | IC2.2 46.99,5.71 45.09,5.71 42.55,8.26 39.39,8.26
N$14  (via drill 0.7)
  Top 0.254: IC5.3 53.98,52.7 52.7,51.44 v40.64,51.44
  Bottom 0.254: IC1.14 37.47,24.77 38.73,26.04 38.73,32.38 40.01,33.66 40.01,38.73 40.64,39.37 40.64,41.91 41.91,43.18 41.91,46.99 41.27,47.62 40.64,47.62 40.01,48.26 40.01,50.16 40.64,50.8 v40.64,51.44
N$15
  Top 0.254: IC7.4 58.42,95.25 59.69,93.98 59.69,88.27 60.96,87 RN1.2 IC6.2
N$16  (via drill 0.7)
  Top 0.254: IC5.4 53.98,50.16 52.7,48.9 43.18,48.9 42.55,49.53 v41.27,49.53
  Bottom 0.254: IC1.15 37.47,22.23 39.37,24.13 39.37,31.75 40.64,33.02 40.64,38.1 41.27,38.73 41.27,41.27 42.55,42.55 42.55,47.62 41.27,48.9 v41.27,49.53
N$17
  Top 0.254: IC5.5 57.78,47.62 58.42,46.99 58.42,33.02 57.78,32.38 57.15,32.38 54.61,29.84 54.61,21.59 52.7,19.68 IC1.17
N$18
  Top 0.254: IC1.18 53.34,22.23 53.98,22.86 53.98,30.48 56.52,33.02 57.15,33.02 57.78,33.66 57.78,44.45 57.15,45.09 IC5.6
N$19
  Top 0.254: IC5.7 56.52,42.55 57.15,41.91 57.15,34.29 56.52,33.66 55.88,33.66 53.34,31.11 53.34,25.4 52.7,24.77 IC1.19
N$20
  Top 0.254: IC5.8 53.34,40.01 52.07,38.73 49.53,38.73 48.26,37.47 48.26,27.94 48.9,27.3 IC1.20
N$21
  Top 0.254: IC1.21 52.07,29.84 52.7,30.48 52.7,31.75 53.34,32.38 53.34,35.56 IC5.9
N$22
  Top 0.305: IC4.12 76.83,31.75 76.83,19.68 R14.P$1
N$23
  Bottom 0.305: IC4.10 76.83,24.77 76.83,13.34 R16.P$1
N$24
  Top 0.254: IC7.5 55.88,95.25 57.15,93.98 57.15,88.27 58.42,87 RN1.3 IC6.3
N$25
  Top 0.254: IC7.6 53.34,95.25 54.61,93.98 54.61,88.27 55.88,87 RN1.4 IC6.4
N$26
  Top 0.254: IC7.7 50.8,95.25 52.07,93.98 52.07,88.27 53.34,87 RN1.5 IC6.5
N$27
  Top 0.254: IC7.9 48.26,88.9 50.16,87 50.16,86.36 RN1.6 IC6.6
N$28
  Top 0.254: IC7.10 50.8,91.44 50.16,92.08 47.62,92.08 46.99,91.44 46.99,88.27 48.26,87 RN1.7 IC6.7
N$29  (via drill 0.7)
  Top 0.254: IC6.8 RN1.8 v45.72,90.81
  Bottom 0.254: IC7.11 53.34,91.44 46.99,91.44 v45.72,90.81
N$30  (via drill 0.7)
  Top 0.254: v43.81,90.81 43.18,89.53 RN1.9 IC6.9
  Bottom 0.254: IC7.12 55.88,91.44 54.61,92.08 43.81,92.08 v43.81,90.81
N$31
  Top 0.254: IC8.2 69.85,54.61 71.12,55.88 76.83,55.88 77.6,55.5 81.03,55.5 81.28,55.88 81.28,59.05 80.01,60.33 R2.P$1
N$32
  Top 0.61: R2.P$2 J-DRV4.1
N$33
  Top 0.61: R3.P$2 90.17,57.15 90.17,57.78 J-DRV4.2
N$34
  Bottom 0.305: IC8.12 76.83,52.07 R4.P$1
N$35
  Top 0.61: R4.P$2 90.17,53.98 91.44,55.24 J-DRV4.3
N$36
  Top 0.61: R5.P$2 91.44,52.7 J-DRV4.4
N$37  (via drill 0.8)
  Top 0.305: v20.95,50.8 21.59,50.8 22.23,51.44 22.86,51.44 24.13,52.7 24.13,53.34 24.77,53.98 25.4,53.98 29.84,58.42 IC9.9
  Bottom 0.305: IC11.2 10.16,68.58 10.79,67.94 10.79,58.42 12.06,57.15 12.06,56.52 14.61,53.98 17.78,53.98 v20.95,50.8
N$38
  Top 0.305: IC8.4 69.22,49.53 70.48,50.8 75.56,50.8 78.74,47.62 R6.P$1
N$39
  Top 0.61: R6.P$2 J-DRV3.1
N$40
  Top 0.305: R28.P$2 R33.P$1 LED.2
N$41
  Top 0.61: R7.P$2 90.81,43.18 91.44,43.81 J-DRV3.2
N$42
  Bottom 0.305: SW-OFF.2 8.26,14.61 11.43,17.78 R25.P$2
N$43
  Bottom 0.254: J5.3 33.66,90.81 33.66,87 33.02,86.36 R27.P$1
N$44
  Bottom 0.305: IC8.10 74.93,46.99 77.34,44.7 80.39,44.7 80.77,44.32 80.77,40.77 80.01,40.01 R8.P$1
N$45
  Top 0.305: SW-ON.2 8.89,33.66 R26.P$2
N$46
  Top 0.61: R8.P$2 91.44,40.01 92.71,41.27 J-DRV3.3
N$47
  Top 0.61: R9.P$2 91.44,36.83 93.34,38.73 J-DRV3.4 95.25,38.73
N$48
  Bottom 0.254: IC9.10 IC9.11
N$49
  Top 0.305: IC8.6 69.85,44.45 71.12,43.18 76.2,43.18 76.2,34.92 R10.P$1
N$50
  Top 0.61: R10.P$2 J-DRV2.1
N$51
  Top 0.254: 13.97,37.85 14.48,38.48 14.48,39.5 14.61,39.62 14.61,45.09
  Top 0.305: R21.P$1 13.97,37.85 | 14.61,45.09 13.97,45.72 13.34,45.72 10.79,48.26 10.79,66.67 13.97,69.85 19.05,69.85 20.32,71.12 IC9.1
  Bottom 0.305: C3.1 21.59,73.66 22.86,72.39 IC9.1
N$52
  Top 0.61: R11.P$2 91.44,29.21 92.08,29.84 J-DRV2.2
N$53  (via drill 0.8)
  Top 0.305: v19.05,66.04 IC9.3
  Bottom 0.305: IC11.1 12.7,71.12 13.97,69.85 17.78,69.85 19.05,68.58 v19.05,66.04
N$54  (via drill 0.8)
  Top 0.254: 17.14,33.02 18.54,34.29 18.54,36.83 17.78,37.47 17.78,53.34 | 20.32,53.98 20.32,54.48 20.45,54.61 20.45,57.4 20.32,57.53 20.32,60.96
  Top 0.305: v14.61,74.3 v19.68,74.3 28.57,74.3 28.57,69.22 29.21,68.58 IC9.13 31.11,68.58 | R22.P$1 17.14,26.67 16.51,27.3 16.51,33.02 17.14,33.02 | 17.78,53.34 18.41,53.98 20.32,53.98 | 20.32,60.96 v19.05,60.96
  Bottom 0.254: v14.61,74.3 C4.2 | 20.32,60.96 20.32,62.36 20.83,62.87 20.83,64.52 20.32,65.02 20.32,73.03
  Bottom 0.305: v19.05,60.96 20.32,60.96 | 20.32,73.03 19.68,73.66 v19.68,74.3
N$55
  Bottom 0.305: IC8.8 76.2,41.91 76.2,35.56 76.83,34.92 80.01,34.92 81.28,33.66 81.28,27.94 R12.P$1
N$56
  Top 0.61: R12.P$2 91.44,26.04 92.71,27.3 J-DRV2.3
N$57
  Top 0.61: R13.P$2 91.44,22.86 93.34,24.77 J-DRV2.4
N$58
  Top 0.305: R23.P$1 O1.1
N$60
  Top 0.305: SW-OFF.1 7.62,12.06 8.26,12.7 O1.2
N$61
  Top 0.61: R14.P$2 J-DRV1.1
N$62
  Top 0.61: R15.P$2 90.81,14.61 91.44,15.24 J-DRV1.2
N$63
  Top 0.305: R24.P$1 O2.1
N$65
  Top 0.61: R16.P$2 90.81,11.43 92.08,12.7 J-DRV1.3
N$66
  Top 0.61: R17.P$2 90.81,8.26 92.71,10.16 J-DRV1.4
N$67
  Top 0.305: SW-ON.1 5.71,31.11 4.45,32.38 4.45,34.29 5.71,35.56 7.62,35.56 O2.2
N$69
  Top 0.305: IC11.12 16.51,66.04 19.05,68.58 IC9.2
N$70  (via drill 0.8)
  Top 0.305: v19.05,59.05 18.41,59.05 17.78,59.69 17.78,61.59 17.14,62.23 13.97,62.23 13.34,62.87 13.34,67.94 13.97,68.58 IC11.13
  Bottom 0.305: IC9.6 19.68,58.42 v19.05,59.05
N$71  (via drill 0.7, 0.8)
  Top 0.254: 19.05,49.53 19.05,52.07 19.68,52.7 22.61,52.7 24.77,54.74 24.77,59.05 IC9.5
  Top 0.305: IC10.7 28.57,22.23 24.77,26.04 23.5,26.04 v22.23,27.3 | 19.05,49.53 19.05,38.73 19.68,38.1 19.68,31.75 18.41,30.48 v18.41,29.21
  Bottom 0.254: IC9.5 25.4,63.5 25.4,86.36 24.77,87 20.95,87 19.68,88.27 J5.14
  Bottom 0.305: v22.23,27.3 v18.41,29.21
N$72
  Top 0.305: IC10.1 24.77,24.77 26.67,22.86 26.67,19.05 28.57,17.14 IC10.5
N$73  (via drill 0.8)
  Top 0.305: v82.55,5.71 82.55,2.54 81.92,1.91 46.99,1.91 46.35,1.27 27.94,1.27 20.95,8.26 v20.95,11.43 | v81.28,74.3 v81.28,64.77
  Bottom 0.305: R18.P$2 R31.P$1 80.01,81.92 81.28,80.64 v81.28,74.3 | v81.28,64.77 81.28,60.33 81.92,59.69 81.92,40.01 82.55,39.37 v82.55,5.71 | v20.95,11.43 20.95,15.24 IC10.4
N$74
  Top 0.305: LED.1 12.7,60.33 13.97,60.96 IC11.10
N$75  (via drill 0.7, 0.8)
  Top 0.305: R34.P$2 57.15,18.41 56.52,17.78 v35.56,17.78 34.29,17.78 32.38,15.88 32.38,10.16 v29.21,6.99
  Top 0.406: IC2.11 R34.P$2
  Bottom 0.254: 34.92,60.96 D1.A
  Bottom 0.305: v35.56,17.78 34.29,17.78 33.66,18.41 33.66,20.32 34.29,20.95 37.47,20.95 41.27,24.77 41.27,37.47 41.91,38.1 41.91,40.64 43.18,41.91 43.18,50.8 41.91,52.07 41.91,53.34 40.01,55.24 40.01,55.88 34.92,60.96 | J-SYNC.2 18.41,6.35 19.05,6.99 v29.21,6.99
OFF
  Top 0.305: R19.P$1 14.61,23.5 14.29,23.81 | 14.29,23.81 13.97,24.13 R21.P$2 | O1.4 7.62,23.5 13.97,23.5 14.29,23.81
ON  (via drill 0.8)
  Top 0.254: v3.17,86.36 4.45,87.63 12.7,87.63 J5.18
  Top 0.305: R22.P$2 16.51,35.56 14.61,33.66 12.45,33.78 12.45,36.58 6.35,42.55 O2.4
  Top 0.406: R20.P$1 4.45,76.83 5.08,76.2 5.08,47.62 6.35,46.35 O2.4
  Bottom 0.254: R20.P$1 5.71,80.01 5.71,86.36 v3.17,86.36
SCL  (via drill 0.7)
  Top 0.254: v41.91,91.44 41.91,92.71 40.64,93.98 29.21,93.98 J5.7
  Top 0.406: J5.7 J5.8
  Bottom 0.254: IC7.14 60.96,91.44 59.69,92.71 43.18,92.71 v41.91,91.44
SDA  (via drill 0.7)
  Top 0.254: v40.01,91.44 40.01,92.08 38.73,93.34 30.48,93.34 29.84,92.71 J5.5
  Top 0.406: J5.5 J5.6
  Bottom 0.254: IC7.15 63.5,90.17 60.33,93.34 41.91,93.34 v40.01,91.44
SMALL_L
  Top 0.254: IC5.17 64.14,51.44 64.77,51.44 65.41,52.07 IC8.3 71.75,52.07 73.03,53.34 75.56,53.34 76.83,52.07 76.83,50.8 | 81.28,44.45 80.01,43.18 R7.P$1
  Top 0.305: 76.83,50.8 79.38,48.26 80.64,48.26 81.28,47.62 81.28,44.45
SMALL_R
  Top 0.254: IC5.16 64.14,47.62
  Top 0.305: 64.14,47.62 64.77,48.26 69.85,48.26 71.12,49.53 IC8.11 75.56,49.53 77.47,47.62 77.47,38.73 R9.P$1
SW_CLOCK  (via drill 0.8)
  Top 0.254: IC12.6 35.56,5.4 34.29,5.08 34.29,3.81 | 34.29,3.81 34.29,2.54 29.21,2.54 22.86,8.89 22.86,12.7 20.95,15.88 20.95,27.3 20.32,27.94 20.32,29.21 20.95,29.84 20.95,39.37 20.32,40.01 20.32,47.62 20.95,48.26 22.23,48.26 24.77,50.8 26.04,50.8 26.67,51.44 26.67,53.98 27.3,54.61 31.75,54.61 32.38,55.24 32.38,57.15 33.02,57.78 33.02,61.59 32.38,62.23 26.67,62.23 v25.4,60.96 | R29.P$2 34.29,3.81
  Bottom 0.254: v25.4,60.96 26.04,61.59 26.04,87 25.4,87.63 21.59,87.63 20.95,88.27 20.95,90.81 J5.13
TINY_L
  Top 0.254: IC5.19 64.77,55.24 IC8.1 69.85,57.15 71.12,58.42 76.2,58.42 77.47,57.15 R3.P$1
TINY_R
  Top 0.254: IC5.18 64.77,52.7 65.41,53.34 70.48,53.34 71.75,54.61 IC8.13 76.2,54.61
  Top 0.305: 76.2,54.61 76.83,53.98 76.83,53.34 R5.P$1
VCC  (via drill 0.7, 1)
  Top 0.254: IC1.1 34.29,57.78 33.02,56.52 33.02,53.34 v27.94,53.34 | IC12.5 v34.92,6.35
  Top 0.406: IC7.1 IC7.16
  Top 1.016: J5.11 J5.12
  Top 1.27: v27.94,15.88 27.94,12.06 27.3,12.06 v24.77,9.53 | IC3.16 C8.1 27.94,52.07 v27.94,53.34 | C12.1 IC9.14 | C10.1 IC1.32 | IC5.20 C11.1 62.87,61.59 63.5,62.23 RN2.1 IC6.20 C7.1 v74.3,74.3 | C23.1 C13.1 | C6.1 IC7.16 | v74.3,85.72 RN1.1
  Bottom 0.813: QG1.8 71.75,14.61 | C1.1 71.75,18.41
  Bottom 1.016: IC8.14 C23.1
  Bottom 1.27: IC3.16 27.94,46.99 v27.94,15.88 | IC9.14 29.21,71.12 27.94,69.85 v27.94,53.34 | IC1.32 48.26,57.78 48.26,20.32 v46.99,19.05 46.99,17.78 45.72,16.51 IC2.16 | IC8.14 71.75,57.15 71.75,39.37 | C13.1 v74.3,74.3 v74.3,85.72 | RN1.1 66.04,85.72 IC7.16 | 71.75,39.37 71.75,18.41 71.75,14.61 v71.75,11.43 | v24.77,9.53 15.24,9.53 14.61,10.16 R19.P$2 | C14.1 71.75,39.37
  pour Top (isolate 0.635, no thermals): 0.64,99.69 99.69,99.69 99.69,0.64 0.64,0.64
X
  Top 0.305: IC11.11 D2.A 20.32,64.77 26.04,64.77 27.3,66.04 IC9.12
  Bottom 0.254: IC9.8 31.11,55.88 32.38,57.15 32.38,64.77 31.11,66.04 IC9.12

### Text on the board
tPlace: Proc | Tiny | Bi-LED | Small | Med | Large | Mack-e- | WarpDrive 201903